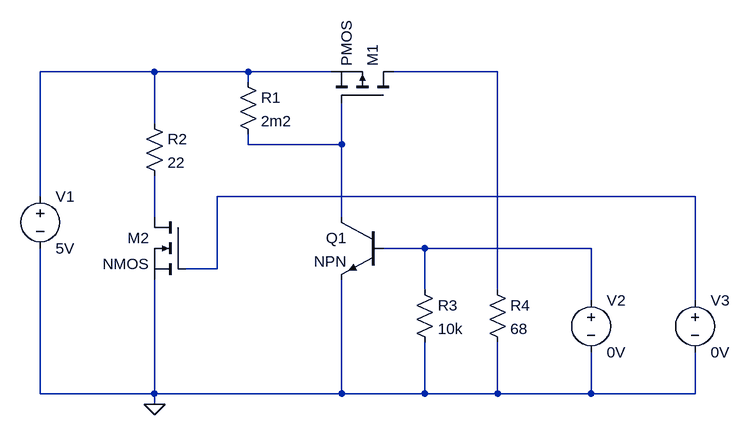
[diagram p0: schematic Draft1.asc]
Draft1.asc, the LTspice schematic file:
Version 4
SHEET 1 880 680
WIRE -64 64 -240 64
WIRE 80 64 -64 64
WIRE 208 64 80 64
WIRE 464 64 304 64
WIRE 80 80 80 64
WIRE -64 144 -64 64
WIRE 80 176 80 160
WIRE 224 176 224 112
WIRE 224 176 80 176
WIRE -240 256 -240 64
WIRE 768 256 32 256
WIRE -64 288 -64 224
WIRE 224 288 224 176
WIRE 352 336 288 336
WIRE 608 336 352 336
WIRE 32 368 32 256
WIRE 32 368 -16 368
WIRE 352 400 352 336
WIRE 464 400 464 64
WIRE 608 416 608 336
WIRE 768 416 768 256
WIRE -240 560 -240 336
WIRE -64 560 -64 384
WIRE -64 560 -240 560
WIRE 224 560 224 384
WIRE 224 560 -64 560
WIRE 352 560 352 480
WIRE 352 560 224 560
WIRE 464 560 464 480
WIRE 464 560 352 560
WIRE 608 560 608 496
WIRE 608 560 464 560
WIRE 768 560 768 496
WIRE 768 560 608 560
WIRE -64 576 -64 560
FLAG -64 576 0
SYMBOL pmos 304 112 M270
SYMATTR InstName M1
SYMBOL res 64 64 R0
SYMATTR InstName R1
SYMATTR Value 2m2
SYMBOL voltage -240 240 R0
WINDOW 123 0 0 Left 0
WINDOW 39 0 0 Left 0
SYMATTR InstName V1
SYMATTR Value 5V
SYMBOL npn 288 288 M0
SYMATTR InstName Q1
SYMBOL nmos -16 288 M0
SYMATTR InstName M2
SYMBOL res -80 128 R0
SYMATTR InstName R2
SYMATTR Value 22
SYMBOL res 336 384 R0
SYMATTR InstName R3
SYMATTR Value 10k
SYMBOL res 448 384 R0
SYMATTR InstName R4
SYMATTR Value 68
SYMBOL voltage 608 400 R0
WINDOW 123 0 0 Left 0
WINDOW 39 0 0 Left 0
SYMATTR InstName V2
SYMATTR Value 0V
SYMBOL voltage 768 400 R0
WINDOW 123 0 0 Left 0
WINDOW 39 0 0 Left 0
SYMATTR InstName V3
SYMATTR Value 0V

The netlist it stands for:
* Draft1.asc
M1 N002 N003 N001 N001 PMOS
R1 N001 N003 2m2
V1 N001 0 5V
Q1 N003 N006 0 0 NPN
M2 N005 N004 0 0 NMOS
R2 N001 N005 22
R3 N006 0 10k
R4 N002 0 68
V2 N006 0 0V
V3 N004 0 0V
.model NPN NPN
.model PNP PNP
.lib standard.bjt
.model NMOS NMOS
.model PMOS PMOS
.lib standard.mos
.backanno
.end